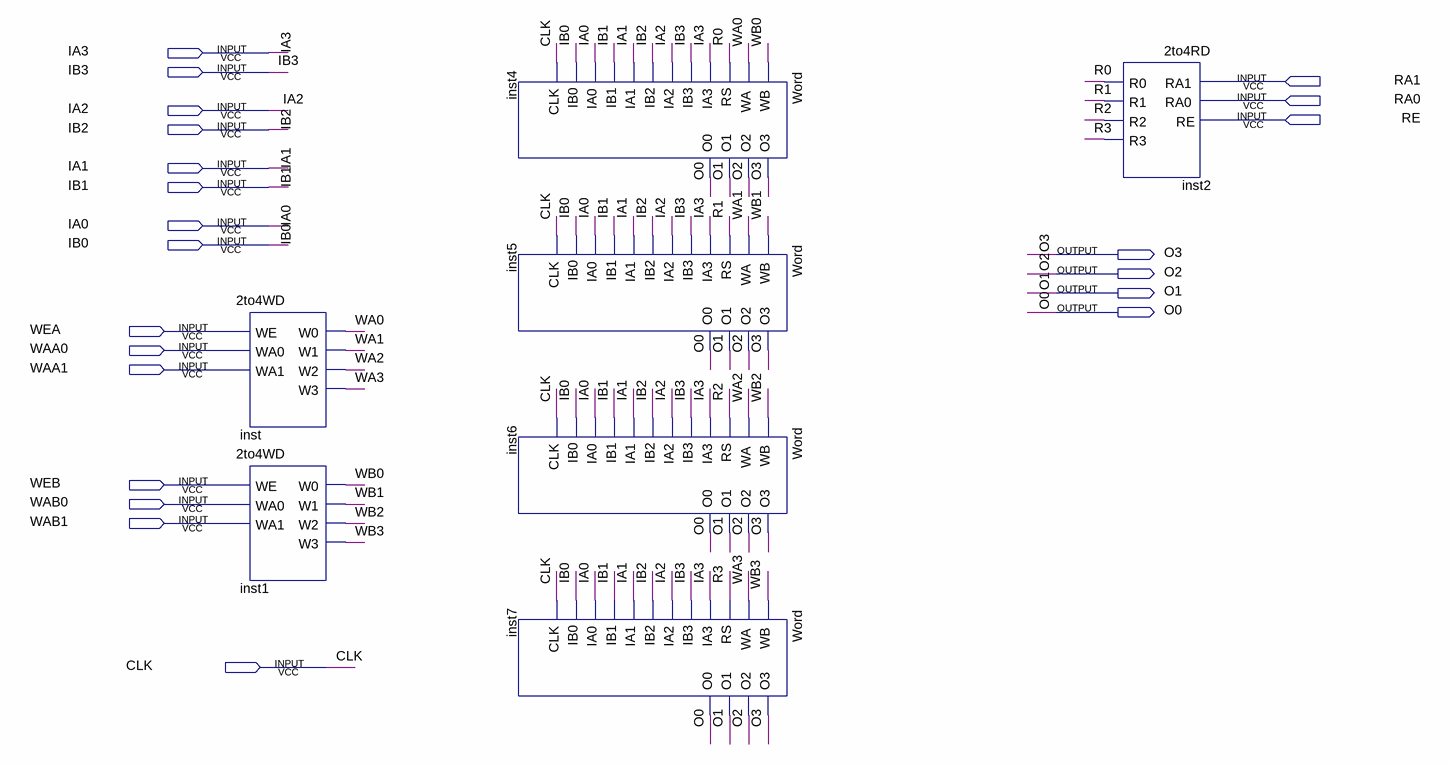
[diagram p0: schematic sheet]
// Quartus schematic 1R2W.bdf as structural Verilog: 7 symbols, 22 pins
module \1R2W  (
  input  IA3,
  input  IB3,
  input  RA1,
  input  RA0,
  input  IA2,
  input  RE,
  input  IB2,
  input  IA1,
  input  IB1,
  input  IA0,
  input  IB0,
  input  WEA,
  input  WAA0,
  input  WAA1,
  input  WEB,
  input  WAB0,
  input  WAB1,
  input  CLK,
  output O3,
  output O2,
  output O1,
  output O0
);

  wire R0, R1, R2, R3, WA0, WA1, WA2, WA3, WB0, WB1, WB2, WB3;

  \2to4WD  inst (.WE(WEA), .WA0(WAA0), .WA1(WAA1), .W0(WA0), .W1(WA1), .W2(WA2), .W3(WA3));
  \2to4WD  inst1 (.WE(WEB), .WA0(WAB0), .WA1(WAB1), .W0(WB0), .W1(WB1), .W2(WB2), .W3(WB3));
  Word inst4 (
    .WB(WB0), .WA(WA0), .RS(R0), .IA3(IA3), .IB3(IB3), .IA2(IA2), .IB2(IB2), .IA1(IA1), .IB1(IB1), .IA0(IA0),
    .IB0(IB0), .CLK(CLK), .O3(O3), .O2(O2), .O1(O1), .O0(O0));
  Word inst5 (
    .WB(WB1), .WA(WA1), .RS(R1), .IA3(IA3), .IB3(IB3), .IA2(IA2), .IB2(IB2), .IA1(IA1), .IB1(IB1), .IA0(IA0),
    .IB0(IB0), .CLK(CLK), .O3(O3), .O2(O2), .O1(O1), .O0(O0));
  Word inst6 (
    .WB(WB2), .WA(WA2), .RS(R2), .IA3(IA3), .IB3(IB3), .IA2(IA2), .IB2(IB2), .IA1(IA1), .IB1(IB1), .IA0(IA0),
    .IB0(IB0), .CLK(CLK), .O3(O3), .O2(O2), .O1(O1), .O0(O0));
  Word inst7 (
    .WB(WB3), .WA(WA3), .RS(R3), .IA3(IA3), .IB3(IB3), .IA2(IA2), .IB2(IB2), .IA1(IA1), .IB1(IB1), .IA0(IA0),
    .IB0(IB0), .CLK(CLK), .O3(O3), .O2(O2), .O1(O1), .O0(O0));
  \2to4RD  inst2 (.RA1(RA1), .RA0(RA0), .RE(RE), .R0(R0), .R1(R1), .R2(R2), .R3(R3));
endmodule
